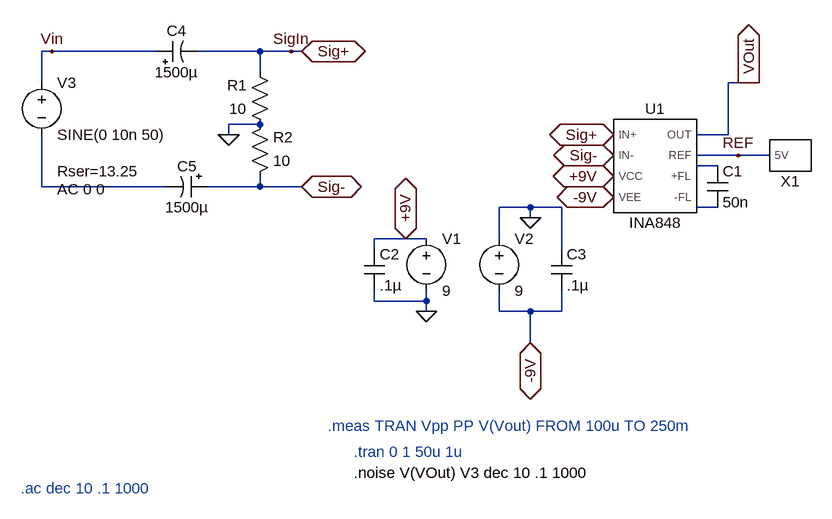
[diagram p0: schematic Amplifier.asc]
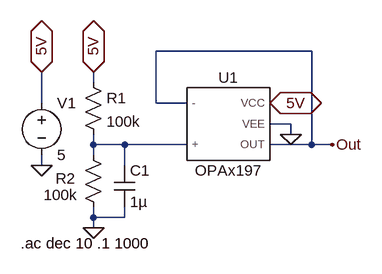
[diagram p1: sub-circuit refamp197.asc]
Amplifier.asc, the LTspice schematic file:
Version 4
SHEET 1 880 680
WIRE -672 -16 -688 -16
WIRE -512 -16 -672 -16
WIRE -352 -16 -448 -16
WIRE -304 -16 -352 -16
WIRE -288 -16 -304 -16
WIRE -352 16 -352 -16
WIRE -688 32 -688 -16
WIRE 400 32 368 32
WIRE 416 32 400 32
WIRE -352 96 -400 96
WIRE -400 112 -400 96
WIRE 368 112 368 32
WIRE 368 112 320 112
WIRE 384 144 320 144
WIRE 432 144 384 144
WIRE 352 160 320 160
WIRE 320 176 320 160
WIRE -688 192 -688 112
WIRE -496 192 -688 192
WIRE -352 192 -352 176
WIRE -352 192 -432 192
WIRE -288 192 -352 192
WIRE 64 224 16 224
WIRE 112 224 64 224
WIRE 320 224 320 208
WIRE 352 224 320 224
WIRE 64 240 64 224
WIRE -128 272 -176 272
WIRE -96 272 -128 272
WIRE 16 272 16 224
WIRE -176 288 -176 272
WIRE 112 288 112 224
WIRE -176 368 -176 352
WIRE -96 368 -96 352
WIRE -96 368 -176 368
WIRE -96 384 -96 368
WIRE 16 384 16 352
WIRE 64 384 16 384
WIRE 112 384 112 352
WIRE 112 384 64 384
WIRE 64 432 64 384
FLAG -96 384 0
FLAG 64 240 0
FLAG -128 272 +9V
IOPIN -128 272 BiDir
FLAG 64 432 -9V
IOPIN 64 432 BiDir
FLAG 192 176 +9V
IOPIN 192 176 BiDir
FLAG 192 208 -9V
IOPIN 192 208 BiDir
FLAG -288 -16 Sig+
IOPIN -288 -16 BiDir
FLAG 192 112 Sig+
IOPIN 192 112 BiDir
FLAG -288 192 Sig-
IOPIN -288 192 BiDir
FLAG 192 144 Sig-
IOPIN 192 144 BiDir
FLAG 400 32 VOut
IOPIN 400 32 Out
FLAG -400 112 0
FLAG 384 144 REF
FLAG -672 -16 Vin
FLAG -304 -16 SigIn
SYMBOL cap 336 160 R0
SYMATTR InstName C1
SYMATTR Value 50n
SYMBOL voltage -96 256 R0
WINDOW 123 0 0 Left 0
WINDOW 39 0 0 Left 0
SYMATTR InstName V1
SYMATTR Value 9
SYMBOL voltage 16 256 R0
WINDOW 123 0 0 Left 0
WINDOW 39 0 0 Left 0
SYMATTR InstName V2
SYMATTR Value 9
SYMBOL cap -192 288 R0
SYMATTR InstName C2
SYMATTR Value .1µ
SYMBOL cap 96 288 R0
SYMATTR InstName C3
SYMATTR Value .1µ
SYMBOL voltage -688 16 R0
WINDOW 123 24 180 Left 2
WINDOW 39 24 152 Left 2
SYMATTR Value2 AC 0 0
SYMATTR SpiceLine Rser=13.25
SYMATTR InstName V3
SYMATTR Value SINE(0 10n 50)
SYMBOL res -336 112 R180
WINDOW 0 36 76 Left 2
WINDOW 3 36 40 Left 2
SYMATTR InstName R1
SYMATTR Value 10
SYMATTR SpiceLine tol=20
SYMBOL res -368 192 M180
WINDOW 0 36 76 Left 2
WINDOW 3 36 40 Left 2
SYMATTR InstName R2
SYMATTR Value 10
SYMATTR SpiceLine tol=20
SYMBOL RefAmp197 464 144 R180
SYMATTR InstName X1
SYMBOL AutoGenerated\\INA848 256 160 R0
SYMATTR InstName U1
SYMBOL polcap -512 0 R270
WINDOW 0 32 32 VTop 2
WINDOW 3 0 32 VBottom 2
SYMATTR InstName C4
SYMATTR Value 1500µ
SYMATTR Description Capacitor
SYMATTR Type cap
SYMATTR SpiceLine V=10 Irms=715m Rser=0.093 Lser=29.9n mfg="Würth Elektronik" pn="860020274017 WCAP-ATG5 8x20" type="Al electrolytic"
SYMBOL polcap -432 176 R90
WINDOW 0 0 32 VBottom 2
WINDOW 3 32 32 VTop 2
SYMATTR InstName C5
SYMATTR Value 1500µ
SYMATTR Description Capacitor
SYMATTR Type cap
SYMATTR SpiceLine V=10 Irms=715m Rser=0.093 Lser=29.9n mfg="Würth Elektronik" pn="860020274017 WCAP-ATG5 8x20" type="Al electrolytic"
TEXT -208 600 Left 2 ;.tran 0 1 50u 1u
TEXT -208 632 Left 2 !.noise V(VOut) V3 dec 10 .1 1000
TEXT -248 560 Left 2 ;.meas TRAN Vpp PP V(Vout) FROM 100u TO 250m
TEXT -720 656 Left 2 ;.ac dec 10 .1 1000

refamp197.asc, the sub-circuit schematic file:
Version 4
SHEET 1 880 680
WIRE 416 64 176 64
WIRE 80 112 80 96
WIRE 0 144 0 96
WIRE 176 144 176 64
WIRE 224 144 176 144
WIRE 384 176 352 176
WIRE 384 192 384 176
WIRE 80 208 80 192
WIRE 128 208 80 208
WIRE 224 208 128 208
WIRE 416 208 416 64
WIRE 416 208 352 208
WIRE 448 208 416 208
WIRE 80 224 80 208
WIRE 0 240 0 224
WIRE 128 240 128 208
WIRE 80 320 80 304
WIRE 128 320 128 304
WIRE 128 320 80 320
WIRE 80 336 80 320
FLAG 80 336 0
FLAG 0 240 0
FLAG 384 192 0
FLAG 448 208 Out
FLAG 0 96 5V
IOPIN 0 96 BiDir
FLAG 80 96 5V
IOPIN 80 96 BiDir
FLAG 352 144 5V
IOPIN 352 144 BiDir
SYMBOL voltage 0 128 R0
WINDOW 123 0 0 Left 0
WINDOW 39 0 0 Left 0
SYMATTR InstName V1
SYMATTR Value 5
SYMBOL res 64 96 R0
SYMATTR InstName R1
SYMATTR Value 100k
SYMBOL res 64 208 R0
WINDOW 0 -42 52 Left 2
WINDOW 3 -61 77 Left 2
SYMATTR InstName R2
SYMATTR Value 100k
SYMBOL cap 112 240 R0
SYMATTR InstName C1
SYMATTR Value 1µ
SYMBOL AutoGenerated\\OPAx197 288 176 R0
SYMATTR InstName U1
TEXT -32 360 Left 2 !.ac dec 10 .1 1000

The netlist it stands for:
* Amplifier.asc
C1 N001 N003 50n
V1 +9V 0 9
V2 0 -9V 9
C2 +9V 0 .1µ
C3 0 -9V .1µ
V3 Vin N002 SINE(0 10n 50) AC 0 0 Rser=13.25
R1 0 SigIn 10 tol=20
R2 Sig- 0 10 tol=20
XX1 REF refamp197
XU1 SigIn Sig- +9V -9V VOut REF N001 N003 INA848  ; pins IN+ IN- VCC VEE OUT REF +FL -FL
C4 Vin SigIn 1500µ V=10 Irms=715m Rser=0.093 Lser=29.9n mfg="Würth Elektronik" pn="860020274017 WCAP-ATG5 8x20" type="Al electrolytic"
C5 Sig- N002 1500µ V=10 Irms=715m Rser=0.093 Lser=29.9n mfg="Würth Elektronik" pn="860020274017 WCAP-ATG5 8x20" type="Al electrolytic"

* block symbol definitions
.subckt refamp197 5V
V1 5V 0 5
R1 5V N001 100k
R2 N001 0 100k
C1 N001 0 1µ
XU1 N001 Out 5V 0 Out OPAx197  ; pins + - VCC VEE OUT
.ac dec 10 .1 1000
.ends refamp197

* .tran 0 1 50u 1u
.noise V(VOut) V3 dec 10 .1 1000
* .meas TRAN Vpp PP V(Vout) FROM 100u TO 250m
* .ac dec 10 .1 1000
.lib C:\Users\bismi\OneDrive\Documents\LTspice\SPICEV2\OPAx197.LIB
.lib C:\Users\bismi\OneDrive\Documents\LTspice\SPICEV2\INA848.LIB
.backanno
.end